# Altium project ngoc_maysay.PrjPcb
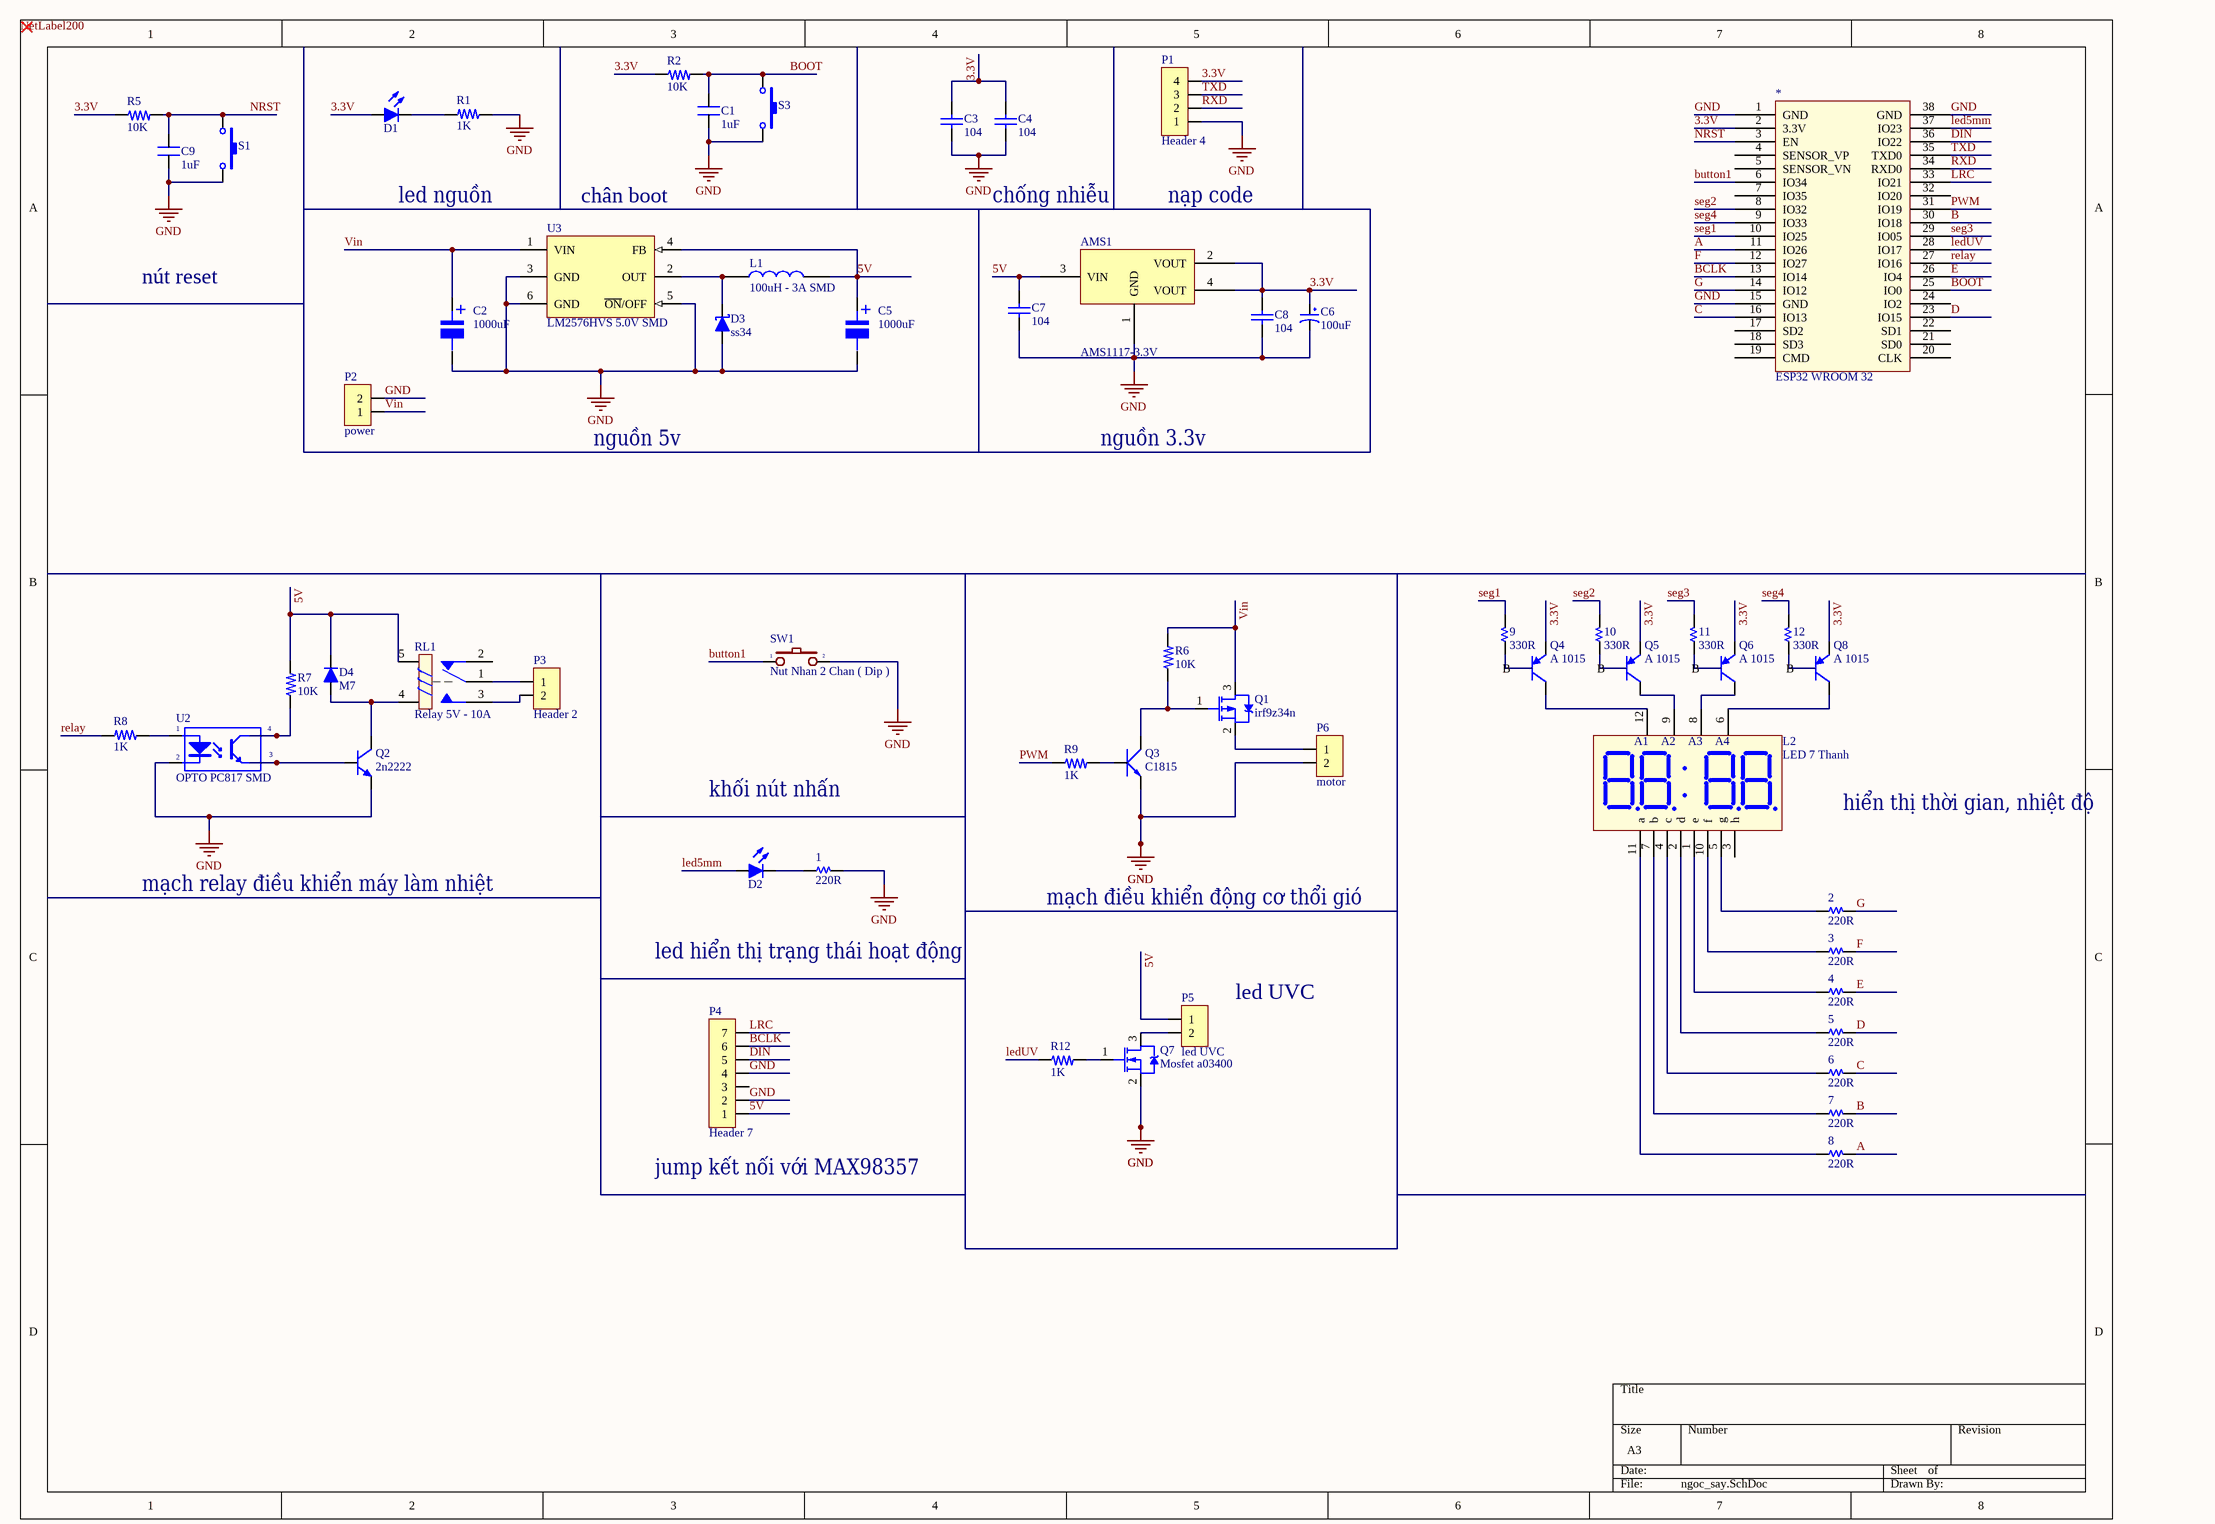
[diagram p0: ngoc_say.SchDoc]
1 sheet, 57 parts. Net scope: global (net labels, ports and power ports of the same name join across sheets).
Board file: Ngoc_say2.PcbDoc

## Sheet ngoc_say.SchDoc
size A3; SheetNumber: 1; SheetTotal: 1

### Parts
1  220R  [R 0805]
2  220R  [R 0805]
3  220R  [R 0805]
4  220R  [R 0805]
5  220R  [R 0805]
6  220R  [R 0805]
7  220R  [R 0805]
8  220R  [R 0805]
9  330R  [R 0805]
10  330R  [R 0805]
11  330R  [R 0805]
12  330R  [R 0805]
*  ESP32 WROOM 32  [ESP32-WROOM-32]
AMS1  AMS1117-3.3V  [SOT223]
C1  1uF  [CAP_0805]
C2  1000uF  [tu nhom 10 (G)]
C3  104  [Tu 0805]
C4  104  [Tu 0805]
C5  1000uF  [tu nhom 10 (G)]
C6  100uF  [tu tantalum smd3528]
C7  104  [Tu 0805]
C8  104  [Tu 0805]
C9  1uF  [CAP_0805]
D1  Led  [Led 0805 RED]  (value not drawn)
D2  Led  [LED 5MM - RED]  (value not drawn)
D3  ss34  [SOD123]
D4  M7  [DO-214AC (SMA) L]
L1  100uH - 3A SMD  [Cuon Cam 7.5x7x5]
L2  LED 7 Thanh  [LED 7x4 0.36]
P1  Header 4  [HDR/Header/4/2mm]
P2  power  [HDR/Header/2/BOX]
P3  Header 2  [HDR/Terminal/2]
P4  Header 7  [HDR/Header/7/2mm]
P5  led UVC  [HDR/Header/2/BOX]
P6  motor  [HDR/Header/2/BOX]
Q1  irf9z34n  [TO-220/HeatSink]
Q2  2n2222  [SOT-23]
Q3  C1815  [SOT23B]
Q4  A 1015  [SOT23]
Q5  A 1015  [SOT23]
Q6  A 1015  [SOT23]
Q7  Mosfet a03400  [SOT-23]
Q8  A 1015  [SOT23]
R1  1K  [RES_0805]
R2  10K  [RES_0805]
R5  10K  [RES_0805]
R6  10K  [RES_0805]
R7  10K  [RES_0805]
R8  1K  [RES_0805]
R9  1K  [RES_0805]
R12  1K  [RES_0805]
RL1  value Relay 5V - 10A  [RELAY5PIN-10A]  (hidden comment: MH)
S1  MH001036  [SW-SMD]  (value not drawn)
S3  MH001036  [SW-SMD]  (value not drawn)
SW1  Nut Nhan 2 Chan ( Dip )  [SW2]
U2  OPTO PC817 SMD  [SOP4]
U3  LM2576HVS 5.0V SMD  [TO263-5]

### Nets
GND: 1.2 *.1(GND) *.15(GND) *.38(GND) AMS1.1(GND) C1.1 C2.2 C3.1 C4.1 C5.2 C6.2 C7.1 C8.1 C9.1 D3.1(A) P1.1 P2.2 P4.2 P4.4 P6.2 Q2.2(E) Q3.3(E) Q7.2(S) R1.2 S1.2 S3.2 SW1.2 U2.2(K) U3.3(GND) U3.5(~{ON}/OFF) U3.6(GND)
3.3V: *.2(3.3V) AMS1.2(VOUT) AMS1.4(VOUT) C3.2 C4.2 C6.1 C8.2 D1.1(A) P1.4 Q4.3(E) Q5.3(E) Q6.3(E) Q8.3(E) R2.2 R5.2
5V: AMS1.3(VIN) C5.1 C7.2 D4.2(K) L1.2 P4.1 P5.1 R7.1 RL1.5 U3.4(FB)
A: 8.2 *.11(IO26)
B: 7.2 *.30(IO18)
BCLK: *.13(IO14) P4.6
BOOT: *.25(IO0) C1.2 R2.1 S3.1
button1: *.6(IO34) SW1.1
C: 6.2 *.16(IO13)
D: 5.2 *.23(IO15)
DIN: *.36(IO22) P4.5
E: 4.2 *.26(IO4)
F: 3.2 *.12(IO27)
G: 2.2 *.14(IO12)
led5mm: *.37(IO23) D2.1(A)
ledUV: *.28(IO17) R12.2
LRC: *.33(IO21) P4.7
NRST: *.3(EN) C9.2 R5.1 S1.1
PWM: *.31(IO19) R9.2
relay: *.27(IO16) R8.1
RXD: *.34(RXD0) P1.2
seg1: 9.2 *.10(IO25)
seg2: 10.2 *.8(IO32)
seg3: 11.2 *.29(IO05)
seg4: 12.2 *.9(IO33)
TXD: *.35(TXD0) P1.3
Vin: C2.1 P2.1 Q1.3(D) R6.1 U3.1(VIN)
Net1_1: 1.1 D2.2(K)
Net2_1: 2.1 L2.5(g)
Net3_1: 3.1 L2.10(f)
Net4_1: 4.1 L2.1(e)
Net5_1: 5.1 L2.2(d)
Net6_1: 6.1 L2.4(c)
Net7_1: 7.1 L2.7(b)
Net8_1: 8.1 L2.11(a)
Net9_1: 9.1 Q4.1(B)
Net10_1: 10.1 Q5.1(B)
Net11_1: 11.1 Q6.1(B)
Net12_1: 12.1 Q8.1(B)
NetD1_2: D1.2(K) R1.1
NetD3_2: D3.2(K) L1.1 U3.2(OUT)
NetD4_1: D4.1(A) Q2.3(C) RL1.4
NetL2_6: L2.6(V4) Q8.2(C)
NetL2_8: L2.8(V3) Q6.2(C)
NetL2_9: L2.9(V2) Q5.2(C)
NetL2_12: L2.12(V1) Q4.2(C)
NetP3_1: P3.1 RL1.1
NetP3_2: P3.2 RL1.3
NetP5_2: P5.2 Q7.3(D)
NetP6_1: P6.1 Q1.2(S)
NetQ1_1: Q1.1(G) Q3.2(C) R6.2
NetQ2_1: Q2.1(B) U2.3(E)
NetQ3_1: Q3.1(B) R9.1
NetQ7_1: Q7.1(G) R12.1
NetR7_2: R7.2 U2.4(C)
NetR8_2: R8.2 U2.1(A)

Not connected (* = marked no-connect by the designer): * 4(SENSOR_VP) 5(SENSOR_VN) 7(IO35) 17(SD2) 18(SD3) 19(CMD) 20(CLK) 21(SD0) 22(SD1) 24(IO2) 32(IO20); L2 3(h); P4 3; RL1 2

### Notes on the sheet
- led nguồn
- (near U3) chân boot
- chống nhiễu
- nạp code
- nút reset
- nguồn 5v
- nguồn 3.3v
- khối nút nhấn
- hiển thị thời gian, nhiệt độ
- mạch relay điều khiển máy làm nhiệt
- mạch điều khiển động cơ thổi gió
- led hiển thị trạng thái hoạt động
- led UVC
- (near P4) jump kết nối với MAX98357
- Labels drawn without touching a wire or pin: NetLabel200
- (in symbol LED 7x4 0.36 Anot) A1; A2; A3; A4
- (in symbol Tu Nhom 1000uF 16V) +

### Library data of the parts
1-12 = Resistor
AMS1 = AMS1117 SMD: Dán; Value: AMS1117-3.3V SOT223; Don_Vi: Con; Ma_Hang: MH000596; Ghi_Chu: *; Kieu_Chan: *; Chung_Loai: Dán
C1 C9 = CAP_1uF-50V-5%-0805: 1µF ±5% 50V Ceramic Capacitor X7R 0805 (2012 Metric); Manufacturer: Yageo; Manufacturing Part Number: CC0805JKX7R9BB105; Case/Package: 0805 (2012 Metric); Supplier-1: Digikey; Supplier Part Number-1: 311-3498-1-ND
C2 C5 = Tu Nhom 1000uF 16V: Dán; Don_Vi: Con; So_Chan: 2; Ten_Linh_Kien: Tụ Nhôm 1000uF 16V 10x10MM; Ma_Hang: MH004419; Chung_Loai: Dán; Kieu_Chan: *
C3 C4 C7 C8 = Tu 104: Dán; Ten_Linh_Kien: Tụ 0805 104-100nF 10% 50V; Don_Vi: Con; Ma_Hang: MH004551; Kieu_Chan: *; Chung_Loai: Dán; Ghi_Chu: *
C6 = Tu tantalum 100uF 6.3V SMD3528: Dán; Don_Vi: Con; So_Chan: 2; Ten_Linh_Kien: Tụ tantalum 107J-100uF 6.3V SMD3528; Ma_Hang: MH007595; Chung_Loai: Dán; Kieu_Chan: *
D1 D2 = Led: Typical LED
D3 = Diode Schottky: Schottky Diode
D4 = Diode: Default Diode
L1 = CUON CAM 100uH_SMD: Dán; Don_Vi: Con; Ma_Hang: MH003999; Ten_Linh_Kien: Cuộn Cảm 100uH 7x7x4MM CD74; Ma_Hang: *; Kieu_Chan: *; Chung_Loai: Dán
L2 = LED 7x4 0.36 Anot: Dán; Don_Vi: Con; Ma_Hang: MH001048; Ten_Linh_Kien: Led 7 0.36 4 Số Anot (Sáng Đỏ); Ghi_Chu: *; Kieu_Chan: *; Chung_Loai: Dán
P1 = Header 4: Header, 4-Pin
P2 P3 P5 P6 = Header 2: Header, 2-Pin
P4 = Header 7: Header, 7-Pin
Q1 = Mosfet P: pin to pad: 2>3 3>2
Q2 = Transistor NPN: NPN Bipolar Transistor
Q3 = C1815: Dán; Ten_Linh_Kien: C1815 SOT23 TRANS NPN 0.15A 50V (SMD-HF); Don_Vi: Con; Ma_Hang: MH000946; Ghi_Chu: *; Kieu_Chan: *; Chung_Loai: Dán
Q4-Q6 Q8 = 2SA1015: Dán; Ten_Linh_Kien: A1015 SOT23 TRANS PNP 0.15A 50V ( SMD-BA); Ma_Hang: MH001957; Don_Vi: Con; Chung_Loai: Dán
Q7 = Mosfet N
R1 R8 R9 R12 = RES_1K-0.125W-1%-0805: 1 kOhms ±1% 0.125W, 1/8W Chip Resistor 0805 (2012 Metric) Moisture Resistant Thick Film; Manufacturer: 垈㎵á; Manufacturer Part Number: RC0805FR-071KL; Case/Package: 0805; Supplier-1: Digikey; Supplier Part Number-1: 311-1.00KCRCT-ND
R2 R5-R7 = RES_10K-0.125W-1%-0805: 10 kOhms ±1% 0.125W, 1/8W Chip Resistor 0805 (2012 Metric) Moisture Resistant Thick Film; Manufacturer: Yageo; Manufacturing Part Number: RC0805FR-0710KL; Case/Package: 0805; Supplier-1: Digikey; Supplier Part Number-1: 311-10.0KCRCT-ND
RL1 = Relay 10A: Cắm
S1 S3 = SW-SMD: Dán; Value: Nút Nhấn 2 Chân 3x6x2.5MM SMD
SW1 = Nut Nhan 2 Chan ( Dip ): Cắm; Ten_Linh_Kien: Nút Nhấn 2 Chân 6x6x5MM DIP; Ma_Hang: MH001959; Don_Vi: Con; Kieu_Chan: *; Ghi_Chu: *; Chung_Loai: Cắm
U2 = OPTO PC817 SMD: Single Opto; Value: PC817
U3 = LM2576HVS 5.0V SMD: Dán; Ten_Linh_Kien: LM2576HVS-5.0V BUCK 5V 3A TO263-5; Don_Vi: Con; Ma_Hang: MH002362; Ghi_Chu: *; Kieu_Chan: *; Chung_Loai: Dán